# EAGLE schematic fet_high_side_switch (EAGLE 6.4)
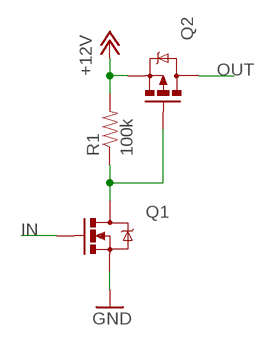
[diagram p0: schematic, sheet 1]

## Parts
Q1  MOSFET-NCHANNEL2N7000  [TO-92]
Q2  MOSFET-PCHANNELSMD  [SOT23-3]
R1  100k  RESISTOR0402-RES  [0402-RES]

## Nets
+12V: Q2.2(S) R1.2
GND: Q1.1(S)
IN: Q1.2(G)
N$1: Q1.3(D) Q2.1(G) R1.1
OUT: Q2.3(D)

## Library data of the parts
Q1 = SparkFun-DiscreteSemi:MOSFET-NCHANNEL: Common NMOSFET Parts MFG P/N Store ID Prod ID FDD8780 TRANS-09984 SI7820DN TRANS-11055 FDS6630A IC-08089 2N7002PW TRANS-11151 FQP30N06L COM-10213 TRANS-10060 BSS123LT1G TRANS-08345 BSS138 TRANS-00830 BS170 2N7000
Q2 = SparkFun-DiscreteSemi:MOSFET-PCHANNEL: Generic PMOSFET
R1 = SparkFun-Passives:RESISTOR: Resistor Basic schematic elements and footprints for 0603, 1206, and PTH resistors.